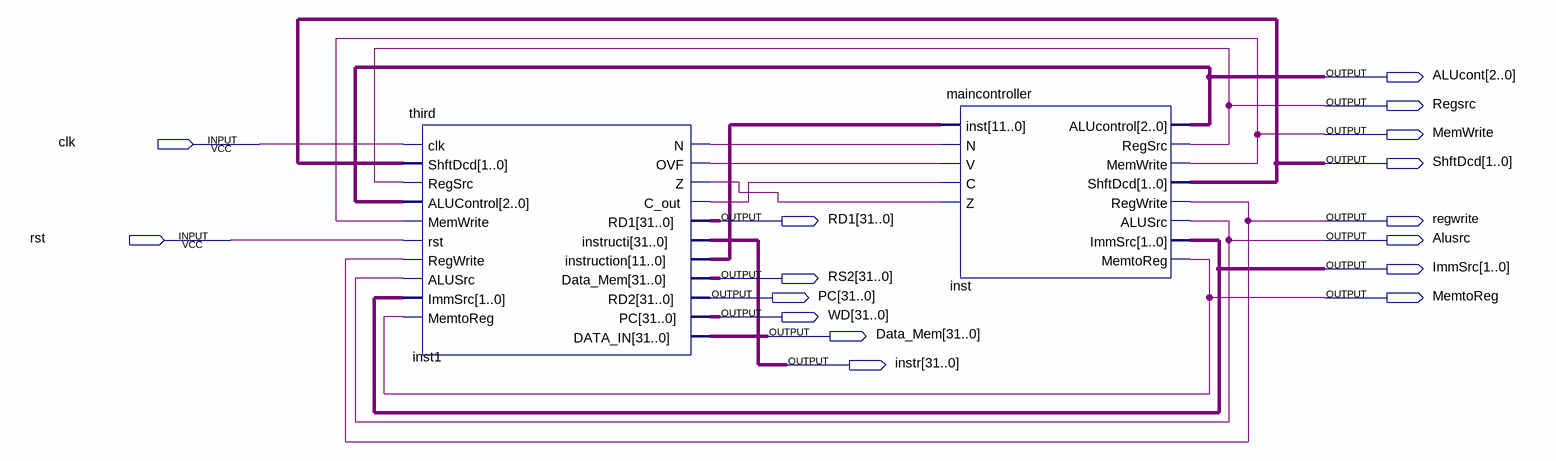
[diagram p0: schematic sheet]
// Quartus schematic total.bdf as structural Verilog: 2 symbols, 16 pins
module total (
  input  clk,
  input  rst,
  output [2:0] ALUcont,
  output Regsrc,
  output MemWrite,
  output [1:0] ShftDcd,
  output [31:0] RD1,
  output regwrite,
  output Alusrc,
  output [1:0] ImmSrc,
  output [31:0] RS2,
  output [31:0] PC,
  output MemtoReg,
  output [31:0] WD,
  output [31:0] Data_Mem,
  output [31:0] instr
);

  wire inst1_c_out, inst1_n, inst1_ovf, inst1_z;
  wire [11:0] inst1_instruction;

  third inst1 (
    .clk(clk), .ShftDcd(ShftDcd), .RegSrc(Regsrc), .ALUControl(ALUcont), .MemWrite(MemWrite), .rst(rst),
    .RegWrite(regwrite), .ALUSrc(Alusrc), .ImmSrc(ImmSrc), .MemtoReg(MemtoReg), .N(inst1_n), .OVF(inst1_ovf),
    .Z(inst1_z), .C_out(inst1_c_out), .RD1(RD1), .instructi(instr), .instruction(inst1_instruction),
    .Data_Mem(RS2), .RD2(PC), .PC(WD), .DATA_IN(Data_Mem));
  maincontroller inst (
    .inst(inst1_instruction), .N(inst1_n), .V(inst1_ovf), .C(inst1_c_out), .Z(inst1_z), .ALUcontrol(ALUcont),
    .RegSrc(Regsrc), .MemWrite(MemWrite), .ShftDcd(ShftDcd), .RegWrite(regwrite), .ALUSrc(Alusrc),
    .ImmSrc(ImmSrc), .MemtoReg(MemtoReg));
endmodule
